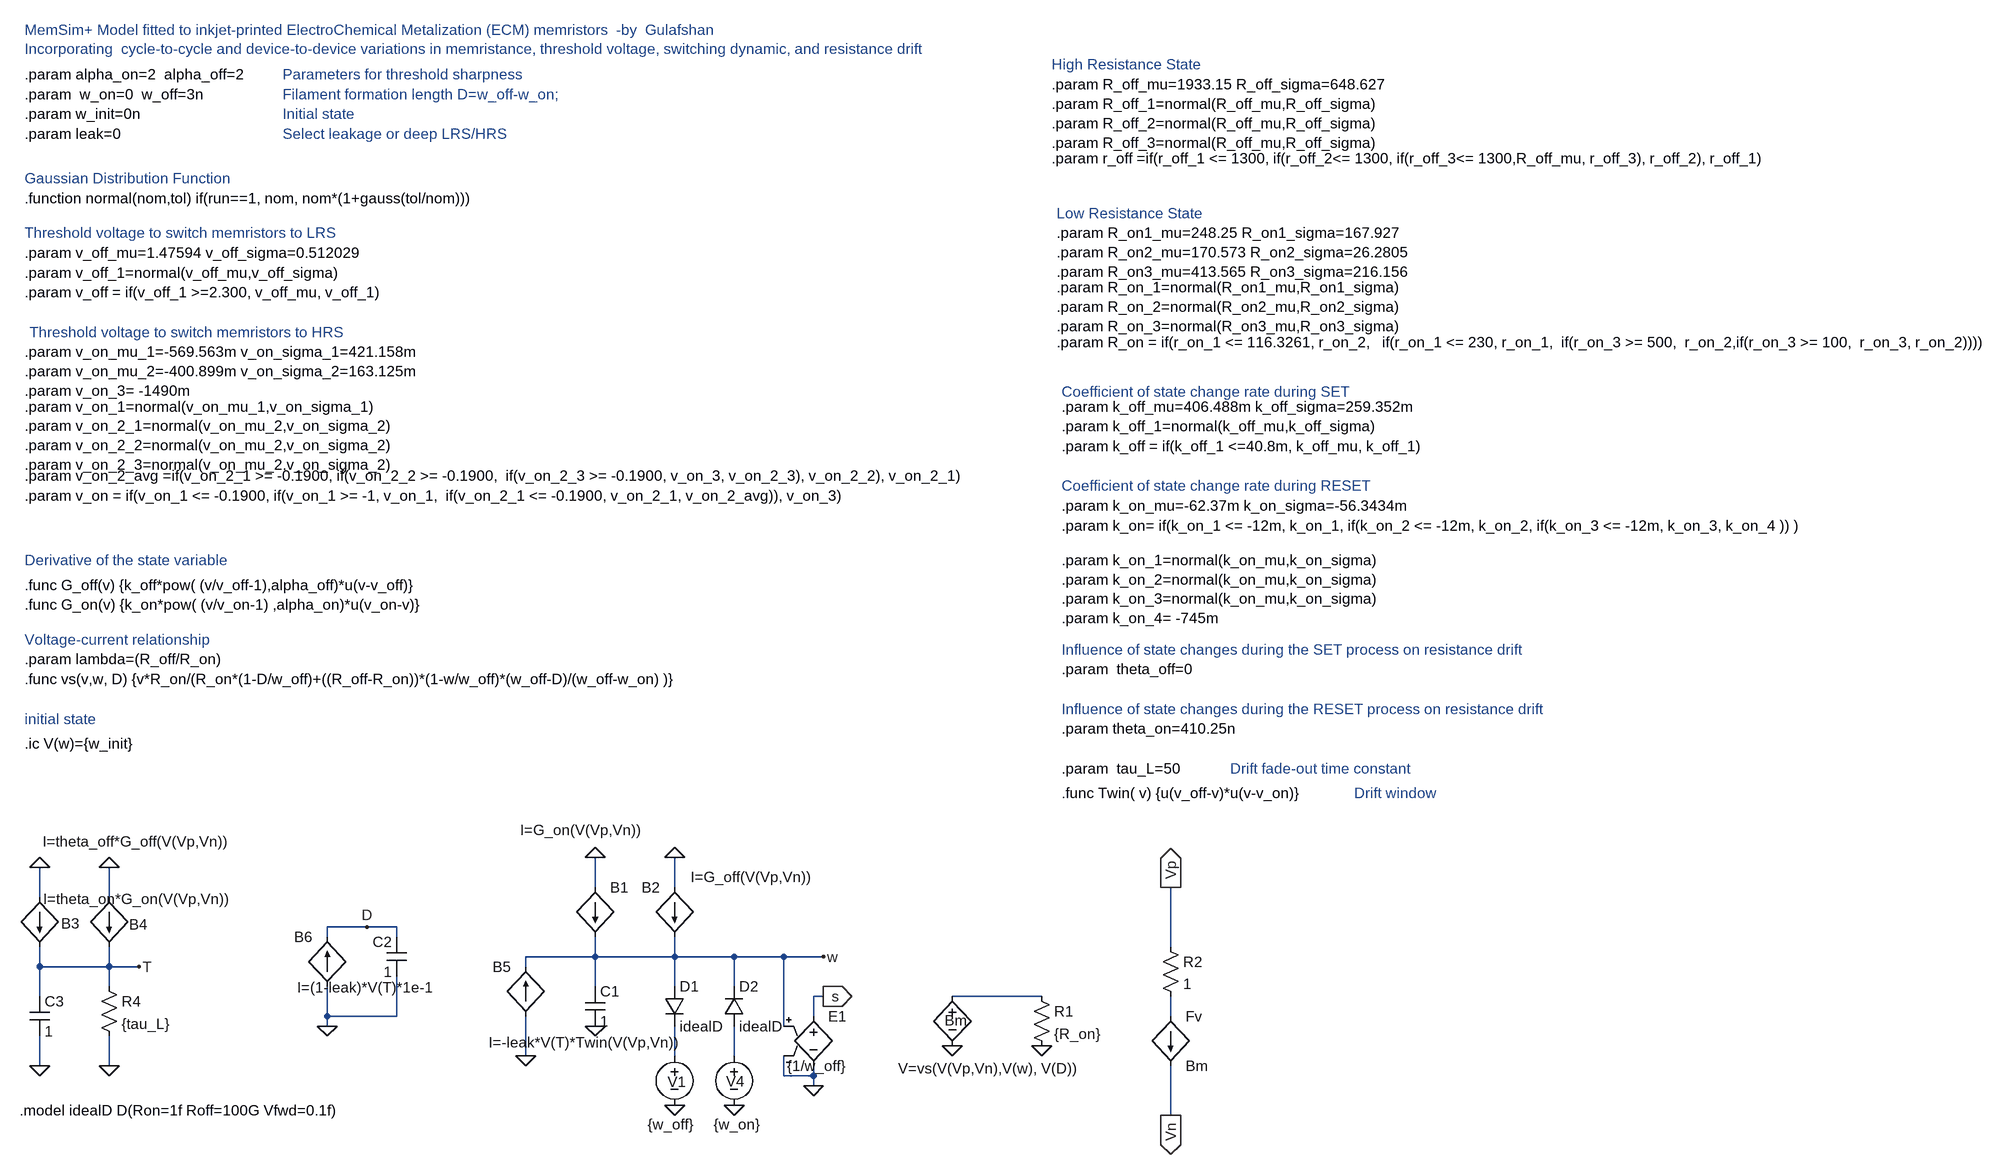
[diagram p0: schematic MemSim+ECM_variation.asc]
MemSim+ECM_variation.asc, the LTspice schematic file:
Version 4
SHEET 1 3964 1792
WIRE 800 640 800 592
WIRE 928 640 928 592
WIRE -96 656 -96 608
WIRE 16 656 16 608
WIRE 432 704 368 704
WIRE 480 704 432 704
WIRE 368 720 368 704
WIRE 480 720 480 704
WIRE 1728 736 1728 640
WIRE 800 752 800 720
WIRE 800 752 688 752
WIRE 928 752 928 720
WIRE 928 752 800 752
WIRE 1024 752 928 752
WIRE 1104 752 1024 752
WIRE 1168 752 1104 752
WIRE -96 768 -96 736
WIRE 16 768 16 736
WIRE 16 768 -96 768
WIRE 64 768 16 768
WIRE 688 768 688 752
WIRE 16 800 16 768
WIRE 800 800 800 752
WIRE 928 800 928 752
WIRE 1024 800 1024 752
WIRE -96 816 -96 768
WIRE 1168 816 1152 816
WIRE 1520 816 1376 816
WIRE 368 848 368 800
WIRE 480 848 480 784
WIRE 480 848 368 848
WIRE 1152 848 1152 816
WIRE 1728 848 1728 816
WIRE 368 864 368 848
WIRE 1104 864 1104 752
WIRE 688 912 688 848
WIRE 928 912 928 864
WIRE 1024 912 1024 864
WIRE -96 928 -96 880
WIRE 16 928 16 880
WIRE 1104 944 1104 912
WIRE 1152 944 1152 928
WIRE 1152 944 1104 944
WIRE 1152 960 1152 944
WIRE 1728 1008 1728 928
FLAG 800 592 0
FLAG 928 592 0
FLAG 800 864 0
FLAG 928 992 0
FLAG 1168 752 w
FLAG 1376 896 0
FLAG 1520 896 0
FLAG 1152 960 0
FLAG 1168 816 s
IOPIN 1168 816 Out
FLAG -96 928 0
FLAG -96 608 0
FLAG 16 608 0
FLAG 16 928 0
FLAG 1024 992 0
FLAG 368 864 0
FLAG 432 704 D
FLAG 688 912 0
FLAG 64 768 T
FLAG 1728 640 Vp
IOPIN 1728 640 Out
FLAG 1728 1008 Vn
IOPIN 1728 1008 Out
SYMBOL bi 800 640 R0
WINDOW 3 -121 -93 Left 2
SYMATTR Value I=G_on(V(Vp,Vn))
SYMATTR InstName B1
SYMBOL bi 928 640 M0
WINDOW 3 -220 -17 Left 2
SYMATTR Value I=G_off(V(Vp,Vn))
SYMATTR InstName B2
SYMBOL cap 784 800 R0
SYMATTR InstName C1
SYMATTR Value 1
SYMBOL diode 912 800 R0
SYMATTR InstName D1
SYMATTR Value idealD
SYMBOL diode 1008 864 M180
WINDOW 0 24 64 Left 2
WINDOW 3 24 0 Left 2
SYMATTR InstName D2
SYMATTR Value idealD
SYMBOL voltage 928 896 R0
WINDOW 123 0 0 Left 2
WINDOW 39 0 0 Left 2
WINDOW 3 -43 126 Left 2
WINDOW 0 -11 58 Left 2
SYMATTR Value {w_off}
SYMATTR InstName V1
SYMBOL res 1504 800 R0
SYMATTR InstName R1
SYMATTR Value {R_on}
SYMBOL f 1728 848 R0
SYMATTR InstName Fv
SYMATTR Value Bm
SYMATTR Value2 -1
SYMBOL bv 1376 800 R0
WINDOW 3 -87 132 Left 2
WINDOW 0 -12 55 Left 2
SYMATTR Value V=vs(V(Vp,Vn),V(w), V(D))
SYMATTR InstName Bm
SYMBOL e 1152 832 R0
WINDOW 3 -42 96 Left 2
SYMATTR Value {1/w_off}
SYMATTR InstName E1
SYMBOL res 1712 720 R0
SYMATTR InstName R2
SYMATTR Value 1
SYMBOL cap -112 816 R0
SYMATTR InstName C3
SYMATTR Value 1
SYMBOL bi -96 656 R0
WINDOW 3 6 3 Left 2
WINDOW 0 35 42 Left 2
SYMATTR Value I=theta_on*G_on(V(Vp,Vn))
SYMATTR InstName B3
SYMBOL bi 16 656 M0
WINDOW 3 -191 -90 Left 2
WINDOW 0 -62 44 Left 2
SYMATTR Value I=theta_off*G_off(V(Vp,Vn))
SYMATTR InstName B4
SYMBOL res 0 784 R0
SYMATTR InstName R4
SYMATTR Value {tau_L}
SYMBOL voltage 1024 896 R0
WINDOW 123 0 0 Left 2
WINDOW 39 0 0 Left 2
WINDOW 3 -33 126 Left 2
WINDOW 0 -13 57 Left 2
SYMATTR Value {w_on}
SYMATTR InstName V4
SYMBOL bi 368 800 R180
WINDOW 3 -169 -1 Left 2
WINDOW 0 24 80 Left 2
SYMATTR Value I=(1-leak)*V(T)*1e-1
SYMATTR InstName B6
SYMBOL cap 496 784 R180
WINDOW 0 24 56 Left 2
WINDOW 3 24 8 Left 2
SYMATTR InstName C2
SYMATTR Value 1
SYMBOL bi 688 848 R180
WINDOW 3 -244 -42 Left 2
WINDOW 0 24 80 Left 2
SYMATTR Value I=-leak*V(T)*Twin(V(Vp,Vn))
SYMATTR InstName B5
TEXT -120 -672 Left 2 !.param alpha_on=2  alpha_off=2
TEXT -120 -640 Left 2 !.param  w_on=0  w_off=3n
TEXT -120 152 Left 2 !.func G_off(v) {k_off*pow( (v/v_off-1),alpha_off)*u(v-v_off)}
TEXT -120 184 Left 2 !.func G_on(v) {k_on*pow( (v/v_on-1) ,alpha_on)*u(v_on-v)}
TEXT -120 -744 Left 2 ;MemSim+ Model fitted to inkjet-printed ElectroChemical Metalization (ECM) memristors  -by  Gulafshan\nIncorporating  cycle-to-cycle and device-to-device variations in memristance, threshold voltage, switching dynamic, and resistance drift
TEXT -120 272 Left 2 !.param lambda=(R_off/R_on)
TEXT -120 408 Left 2 !.ic V(w)={w_init}
TEXT -120 112 Left 2 ;Derivative of the state variable
TEXT -120 368 Left 2 ;initial state
TEXT -128 1000 Left 2 !.model idealD D(Ron=1f Roff=100G Vfwd=0.1f)
TEXT -120 -608 Left 2 !.param w_init=0n
TEXT 1536 -656 Left 2 !.param R_off_mu=1933.15 R_off_sigma=648.627
TEXT 1544 -416 Left 2 !.param R_on1_mu=248.25 R_on1_sigma=167.927\n.param R_on2_mu=170.573 R_on2_sigma=26.2805\n.param R_on3_mu=413.565 R_on3_sigma=216.156
TEXT -120 -472 Left 2 !.function normal(nom,tol) if(run==1, nom, nom*(1+gauss(tol/nom)))
TEXT 1552 384 Left 2 !.param theta_on=410.25n
TEXT 1552 488 Left 2 !.func Twin( v) {u(v_off-v)*u(v-v_on)}
TEXT -120 -384 Left 2 !.param v_off_mu=1.47594 v_off_sigma=0.512029
TEXT -120 -224 Left 2 !.param v_on_mu_1=-569.563m v_on_sigma_1=421.158m\n.param v_on_mu_2=-400.899m v_on_sigma_2=163.125m\n.param v_on_3= -1490m
TEXT -120 -352 Left 2 !.param v_off_1=normal(v_off_mu,v_off_sigma)
TEXT 1544 -328 Left 2 !.param R_on_1=normal(R_on1_mu,R_on1_sigma)\n.param R_on_2=normal(R_on2_mu,R_on2_sigma)\n.param R_on_3=normal(R_on3_mu,R_on3_sigma)
TEXT 1544 -240 Left 2 !.param R_on = if(r_on_1 <= 116.3261, r_on_2,   if(r_on_1 <= 230, r_on_1,  if(r_on_3 >= 500,  r_on_2,if(r_on_3 >= 100,  r_on_3, r_on_2))))
TEXT 1552 -136 Left 2 !.param k_off_mu=406.488m k_off_sigma=259.352m
TEXT 1552 24 Left 2 !.param k_on_mu=-62.37m k_on_sigma=-56.3434m
TEXT 1536 -624 Left 2 !.param R_off_1=normal(R_off_mu,R_off_sigma)\n.param R_off_2=normal(R_off_mu,R_off_sigma)\n.param R_off_3=normal(R_off_mu,R_off_sigma)
TEXT 1536 -536 Left 2 !.param r_off =if(r_off_1 <= 1300, if(r_off_2<= 1300, if(r_off_3<= 1300,R_off_mu, r_off_3), r_off_2), r_off_1)
TEXT -120 -136 Left 2 !.param v_on_1=normal(v_on_mu_1,v_on_sigma_1)\n.param v_on_2_1=normal(v_on_mu_2,v_on_sigma_2)\n.param v_on_2_2=normal(v_on_mu_2,v_on_sigma_2)\n.param v_on_2_3=normal(v_on_mu_2,v_on_sigma_2)
TEXT -120 -24 Left 2 !.param v_on_2_avg =if(v_on_2_1 >= -0.1900, if(v_on_2_2 >= -0.1900,  if(v_on_2_3 >= -0.1900, v_on_3, v_on_2_3), v_on_2_2), v_on_2_1)
TEXT -120 -320 Left 2 !.param v_off = if(v_off_1 >=2.300, v_off_mu, v_off_1)
TEXT -120 8 Left 2 !.param v_on = if(v_on_1 <= -0.1900, if(v_on_1 >= -1, v_on_1,  if(v_on_2_1 <= -0.1900, v_on_2_1, v_on_2_avg)), v_on_3)
TEXT 1552 112 Left 2 !.param k_on_1=normal(k_on_mu,k_on_sigma)\n.param k_on_2=normal(k_on_mu,k_on_sigma)\n.param k_on_3=normal(k_on_mu,k_on_sigma)\n.param k_on_4= -745m
TEXT 1552 -72 Left 2 !.param k_off = if(k_off_1 <=40.8m, k_off_mu, k_off_1)
TEXT 1552 56 Left 2 !.param k_on= if(k_on_1 <= -12m, k_on_1, if(k_on_2 <= -12m, k_on_2, if(k_on_3 <= -12m, k_on_3, k_on_4 )) )
TEXT 1552 -104 Left 2 !.param k_off_1=normal(k_off_mu,k_off_sigma)
TEXT -120 304 Left 2 !.func vs(v,w, D) {v*R_on/(R_on*(1-D/w_off)+((R_off-R_on))*(1-w/w_off)*(w_off-D)/(w_off-w_on) )}
TEXT -120 -576 Left 2 !.param leak=0
TEXT 296 -672 Left 2 ;Parameters for threshold sharpness
TEXT 296 -640 Left 2 ;Filament formation length D=w_off-w_on;
TEXT 296 -608 Left 2 ;Initial state
TEXT 296 -576 Left 2 ;Select leakage or deep LRS/HRS
TEXT -120 -504 Left 2 ;Gaussian Distribution Function
TEXT -120 -416 Left 2 ;Threshold voltage to switch memristors to LRS
TEXT -112 -256 Left 2 ;Threshold voltage to switch memristors to HRS
TEXT -120 240 Left 2 ;Voltage-current relationship
TEXT 1536 -688 Left 2 ;High Resistance State
TEXT 1544 -448 Left 2 ;Low Resistance State
TEXT 1552 -160 Left 2 ;Coefficient of state change rate during SET
TEXT 1552 -8 Left 2 ;Coefficient of state change rate during RESET
TEXT 1552 256 Left 2 ;Influence of state changes during the SET process on resistance drift
TEXT 1552 288 Left 2 !.param  theta_off=0
TEXT 1552 352 Left 2 ;Influence of state changes during the RESET process on resistance drift
TEXT 2024 488 Left 2 ;Drift window
TEXT 1552 448 Left 2 !.param  tau_L=50
TEXT 1824 448 Left 2 ;Drift fade-out time constant

The netlist it stands for:
* MemSim+ECM_variation.asc
B1 0 w I=G_on(V(Vp,Vn))
B2 0 w I=G_off(V(Vp,Vn))
C1 w 0 1
D1 w N003 idealD
D2 N004 w idealD
V1 N003 0 {w_off}
R1 N001 0 {R_on}
Fv N002 Vn Bm -1
Bm N001 0 V=vs(V(Vp,Vn),V(w), V(D))
E1 s 0 w 0 {1/w_off}
R2 Vp N002 1
C3 T 0 1
B3 0 T I=theta_on*G_on(V(Vp,Vn))
B4 0 T I=theta_off*G_off(V(Vp,Vn))
R4 T 0 {tau_L}
V4 N004 0 {w_on}
B6 0 D I=(1-leak)*V(T)*1e-1
C2 0 D 1
B5 0 w I=-leak*V(T)*Twin(V(Vp,Vn))
.model D D
.lib standard.dio
.param alpha_on=2  alpha_off=2
.param  w_on=0  w_off=3n
.func G_off(v) {k_off*pow( (v/v_off-1),alpha_off)*u(v-v_off)}
.func G_on(v) {k_on*pow( (v/v_on-1) ,alpha_on)*u(v_on-v)}
* MemSim+ Model fitted to inkjet-printed ElectroChemical Metalization (ECM) memristors  -by  Gulafshan
* Incorporating  cycle-to-cycle and device-to-device variations in memristance, threshold voltage, switching dynamic, and resistance drift
.param lambda=(R_off/R_on)
.ic V(w)={w_init}
* Derivative of the state variable
* initial state
.model idealD D(Ron=1f Roff=100G Vfwd=0.1f)
.param w_init=0n
.param R_off_mu=1933.15 R_off_sigma=648.627
.param R_on1_mu=248.25 R_on1_sigma=167.927
.param R_on2_mu=170.573 R_on2_sigma=26.2805
.param R_on3_mu=413.565 R_on3_sigma=216.156
.function normal(nom,tol) if(run==1, nom, nom*(1+gauss(tol/nom)))
.param theta_on=410.25n
.func Twin( v) {u(v_off-v)*u(v-v_on)}
.param v_off_mu=1.47594 v_off_sigma=0.512029
.param v_on_mu_1=-569.563m v_on_sigma_1=421.158m
.param v_on_mu_2=-400.899m v_on_sigma_2=163.125m
.param v_on_3= -1490m
.param v_off_1=normal(v_off_mu,v_off_sigma)
.param R_on_1=normal(R_on1_mu,R_on1_sigma)
.param R_on_2=normal(R_on2_mu,R_on2_sigma)
.param R_on_3=normal(R_on3_mu,R_on3_sigma)
.param R_on = if(r_on_1 <= 116.3261, r_on_2,   if(r_on_1 <= 230, r_on_1,  if(r_on_3 >= 500,  r_on_2,if(r_on_3 >= 100,  r_on_3, r_on_2))))
.param k_off_mu=406.488m k_off_sigma=259.352m
.param k_on_mu=-62.37m k_on_sigma=-56.3434m
.param R_off_1=normal(R_off_mu,R_off_sigma)
.param R_off_2=normal(R_off_mu,R_off_sigma)
.param R_off_3=normal(R_off_mu,R_off_sigma)
.param r_off =if(r_off_1 <= 1300, if(r_off_2<= 1300, if(r_off_3<= 1300,R_off_mu, r_off_3), r_off_2), r_off_1)
.param v_on_1=normal(v_on_mu_1,v_on_sigma_1)
.param v_on_2_1=normal(v_on_mu_2,v_on_sigma_2)
.param v_on_2_2=normal(v_on_mu_2,v_on_sigma_2)
.param v_on_2_3=normal(v_on_mu_2,v_on_sigma_2)
.param v_on_2_avg =if(v_on_2_1 >= -0.1900, if(v_on_2_2 >= -0.1900,  if(v_on_2_3 >= -0.1900, v_on_3, v_on_2_3), v_on_2_2), v_on_2_1)
.param v_off = if(v_off_1 >=2.300, v_off_mu, v_off_1)
.param v_on = if(v_on_1 <= -0.1900, if(v_on_1 >= -1, v_on_1,  if(v_on_2_1 <= -0.1900, v_on_2_1, v_on_2_avg)), v_on_3)
.param k_on_1=normal(k_on_mu,k_on_sigma)
.param k_on_2=normal(k_on_mu,k_on_sigma)
.param k_on_3=normal(k_on_mu,k_on_sigma)
.param k_on_4= -745m
.param k_off = if(k_off_1 <=40.8m, k_off_mu, k_off_1)
.param k_on= if(k_on_1 <= -12m, k_on_1, if(k_on_2 <= -12m, k_on_2, if(k_on_3 <= -12m, k_on_3, k_on_4 )) )
.param k_off_1=normal(k_off_mu,k_off_sigma)
.func vs(v,w, D) {v*R_on/(R_on*(1-D/w_off)+((R_off-R_on))*(1-w/w_off)*(w_off-D)/(w_off-w_on) )}
.param leak=0
* Parameters for threshold sharpness
* Filament formation length D=w_off-w_on;
* Initial state
* Select leakage or deep LRS/HRS
* Gaussian Distribution Function
* Threshold voltage to switch memristors to LRS
* Threshold voltage to switch memristors to HRS
* Voltage-current relationship
* High Resistance State
* Low Resistance State
* Coefficient of state change rate during SET
* Coefficient of state change rate during RESET
* Influence of state changes during the SET process on resistance drift
.param  theta_off=0
* Influence of state changes during the RESET process on resistance drift
* Drift window
.param  tau_L=50
* Drift fade-out time constant
.backanno
.end